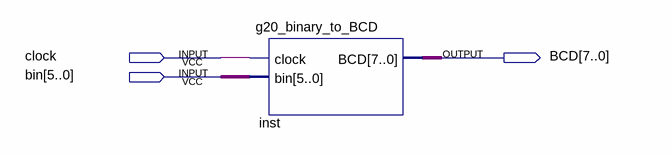
[diagram p0: schematic sheet]
// Quartus schematic Block3.bdf as structural Verilog: 1 symbols, 3 pins
module Block3 (
  input  clock,
  input  [5:0] bin,
  output [7:0] BCD
);

  g20_binary_to_BCD inst (.clock(clock), .bin(bin), .BCD(BCD));
endmodule
